# Altium schematic sheet CAN.SchDoc
size A4; SheetNumber: 2; SheetTotal: 6
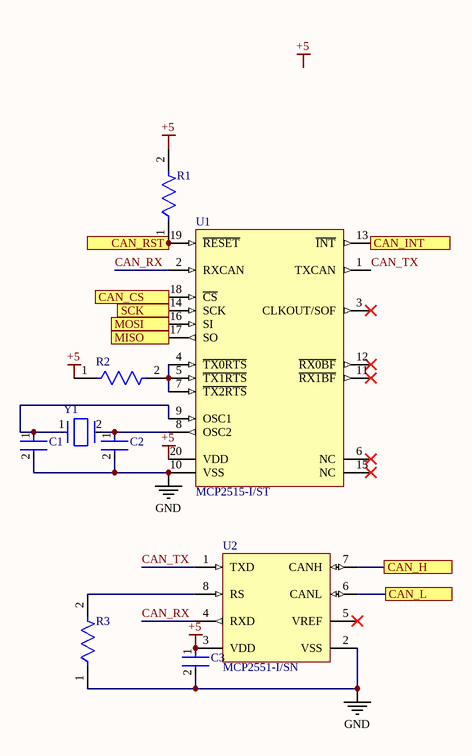
[diagram p0: CAN.SchDoc]

## Parts
C1  C0603C220J5GACTU  [FP-C0603C-CF-MFG]  (value not drawn)
C2  C0603C220J5GACTU  [FP-C0603C-CF-MFG]  (value not drawn)
C3  GRM033R60J104KE19D  [FP-GRM033-0_03-MFG]  (value not drawn)
R1  ERJ-2RKF1003X  [FP-ERJ2RK-IPC_C]  (value not drawn)
R2  ERJ-2RKF1003X  [FP-ERJ2RK-IPC_C]  (value not drawn)
R3  ERJ-3GEYJ100V  [FP-ERJ3G-MFG]  (value not drawn)
U1  MCP2515-I/ST  [TSSOP-ST20_N]
U2  MCP2551-I/SN  [MCHP-SN8_V]
Y1  ABLS-16.000MHZ-K4T  [FP-ABLS-MFG]  (value not drawn)

## Ports
CAN_CS, CAN_H, CAN_INT, CAN_L, CAN_RST, MISO, MOSI, SCK

## Nets
+5: C3.1 R1.2 R2.1 U1.20(VDD) U2.3(VDD)
GND: C1.2 C2.2 C3.2 R3.1 U1.10(VSS) U2.2(VSS)
CAN_CS: U1.18(~{CS}) ; port CAN_CS
CAN_H: U2.7(CANH) ; port CAN_H
CAN_INT: U1.13(~{INT}) ; port CAN_INT
CAN_L: U2.6(CANL) ; port CAN_L
CAN_RST: R1.1 U1.19(~{RESET}) ; port CAN_RST
CAN_RX: U1.2(RXCAN) U2.4(RXD)
CAN_TX: U1.1(TXCAN) U2.1(TXD)
MISO: U1.17(SO) ; port MISO
MOSI: U1.16(SI) ; port MOSI
SCK: U1.14(SCK) ; port SCK
NetC1_1: C1.1 U1.9(OSC1) Y1.1
NetC2_1: C2.1 U1.8(OSC2) Y1.2
NetR2_2: R2.2 U1.4(~{TX0RTS}) U1.5(~{TX1RTS}) U1.7(~{TX2RTS})
NetR3_2: R3.2 U2.8(RS)

Not connected (* = marked no-connect by the designer): U1 3(CLKOUT/SOF)* 6(NC)* 11(~{RX1BF})* 12(~{RX0BF})* 15(NC)*; U2 5(VREF)*

## Notes on the sheet
- Labels drawn without touching a wire or pin: +5

## Library data of the parts
C1 C2 = CMP-2006-03119-3: Cap Ceramic 22pF 50V C0G 5% SMD 0603 125°C Paper T/R; Manufacturer: KEMET; Description: C0603 22 pF C0G 30ppm/°C 5.00% 50 V; Temperature Coefficient: 30ppm/°C; Automotive Grade: Grade 1; Tolerance: 0.05; RoHS: TRUE; Temperature Characteristic: C0G; Capacitance: 22 pF; Device Class L3: Ceramic Capacitors; Digikey Description: Cap Ceramic 22pF 50V C0G 5% SMD 0603 125°C Paper T/R; ComponentLink2URL: https://api.kemet.com/component-edge/download/datasheet/C0603C100J5GACAUTO.pdf; ComponentLink2Description: Datasheet; Automotive: Yes; Temperature: -55°C to +125°C; Temperature Range High: +125°C; Package: C0603C-CF; Device Class L1: Passive Components; Device Class L2: Capacitors; Lead Free: Yes; Value: 22 pF; Manufacturer Part Number: C0603C220J5GACTU; Category: Cap; Mouser Description: Cap Ceramic 22pF 50V C0G 5% SMD 0603 125°C Paper T/R; Voltage Rating: 50 V; Height: 0.87mm; Material: Ceramic; Temperature Range Low: -55°C; Octopart: https://octopart.com/c0603c220j5gactu-kemet-98525
C3 = CMP-06035-000062-2: Chip Multilayer Ceramic Capacitors for General Purpose, 0201, 0.10uF, X5R, 15%, 10%, 6.3V; Capacitance: 100nF; Min Operating Temperature: -55°C; Lead Free: Lead Free; Radiation Hardening: No; Dielectric: X5R; Voltage Rating (DC): 6.3V; REACH SVHC: No SVHC; Case/Package: 0201; Voltage Rating: 6.3V; Length: 0.6mm; Max Operating Temperature: 85°C; Width: 0.012inch; Depth: 0.3mm; Material: Ceramic; Case Code (Metric): 0603; Thickness: 0.013inch; Packaging: Tape and Reel; Height: 0.3mm; Weight: 6E-06oz; Package Quantity: 1; Mount: Surface Mount; Voltage: 6.3V; Case Code (Imperial): 0201; Tolerance: 10%; Termination: SMD/SMT
R1 R2 = CMP-2002-00608-4: RES SMD 100K OHM 1% 1/10W 0402; Resistance: 100kR; Voltage Rating (DC): 50V; Power Rating: 100mW; Temperature Coefficient: 100ppm/°C; Case/Package: 0402; Length: 1mm; Package Quantity: 1; Radiation Hardening: No; Case Code (Metric): 1005; Contact Plating: Tin; Mount: Surface Mount; Depth: 0.5mm; Max Operating Temperature: 155°C; Lead Free: Lead Free; Width: 0.5mm; Composition: Thick Film; Case Code (Imperial): 0402; Tolerance: 1%; Termination: SMD/SMT; Number of Pins: 2; Height: 0.35mm; Voltage Rating: 50V; Military Standard: Not; REACH SVHC: No SVHC; Packaging: Tape and Reel; Min Operating Temperature: -55°C; Max Power Dissipation: 100mW; Features: Automotive AEC-Q200; Number of Terminations: 2
R3 = CMP-2000-00701-2: RES SMD 10 OHM 5% 1/10W 0603; Manufacturer: Panasonic; Voltage Rating: 75V; Power Rating: 0.1W; Description: Thick Film Resistors - SMD 0603 10ohms 5% AEC-Q200; Resistance: 10Ω; Value: 10Ω; Automotive Grade: Grade 0; Temperature Coefficient: 200ppm/°C; Device Class L2: Resistors; Tolerance: 5%; Device Class L3: Chip SMD Resistors; Digikey Description: RES SMD 10 OHM 5% 1/10W 0603; Package: ERJ3G; Automotive: Yes; RoHS: TRUE; Temperature: -55°C to +155°C; Ipc Land Pattern Name: CAPC16080X45; Series: ERJ; Lead Free: Yes; Mouser Description: Thick Film Resistors - SMD 0603 10ohms 5% AEC-Q200; Temperature Range Low: -55°C; Device Class L1: Passive Components; Temperature Range High: +155°C; ComponentLink2URL: https://industrial.panasonic.com/cdbs/www-data/pdf/RDA0000/AOA0000C301.pdf; Category: Res; Manufacturer Part Number: ERJ-3GEYJ100V; Composition: Thick Film; Height: 0.55mm; Footprint Url: https://industrial.panasonic.com/cdbs/www-data/pdf/RDA0000/DMA0000COL17.pdf; Octopart: https://octopart.com/erj-3geyj100v-panasonic-55389239; ComponentLink2Description: Datasheet
U1 = CMP-0186-00077-2: Stand-Alone CAN Controller With SPI Interface, 20-Pin TSSOP, Industrial Temperature; DatasheetVersion: revF, Oct-2010; ComponentLink1Description: Manufacturer URL; PackageDescription: 20-Lead Plastic Thin Shrink Small Outline (ST) - 4.4mm Body [TSSOP]; ComponentLink1URL: http://www.microchip.com/; RevisionNote: URLs added. DatasheetVersion updated.; PackageReference: TSSOP-ST20; Code_JEDEC: MO-153-AC; ComponentLink2Description: Datasheet; ComponentLink2URL: http://ww1.microchip.com/downloads/en/DeviceDoc/21801f.pdf; PackageVersion: revBB, Aug-2009; ComponentLink3URL: http://www.microchip.com/stellent/groups/techpub_sg/documents/packagingspec/en012702.pdf; ComponentLink3Description: Package Specification
U2 = CMP-0186-00138-3: High-Speed CAN Transceiver, / 1 Mb/s, 4.5 to 5.5 V, 8-Pin SOIC (SN), Industrial Temperature, RoHS, Tube; Manufacturer: Microchip; RoHSCompliant: true; PackageReference: SN8; ComponentLink1URL: http://www.microchip.com/; DatasheetVersion: Rev. F, 07/2010; ComponentLink2Description: Datasheet; ComponentLink2URL: http://ww1.microchip.com/downloads/en/DeviceDoc/21667f.pdf; ComponentLink3Description: Package Specification; PackageDescription: 8-Pin Small Outline Integrated Circuit, Body 4.9 x 3.9 mm, Pitch 1.27 mm; ComponentLink1Description: Manufacturer URL; Mounting Technology: Surface Mount; ComponentLink3URL: http://www.microchip.com/stellent/groups/techpub_sg/documents/packagingspec/en012702.pdf
Y1 = CMP-27762-000003-1: CRYSTAL 16.0000MHZ 18PF SMD; Manufacturer: Abracon; Frequency: 16MHz; Stability: 50ppm; Tolerance: 30ppm; Description: 16MHz ±30ppm Crystal 18pF 40 Ohms HC-49/US; Standoff Height: 0mm; Esr: 40Ω; ComponentLink2URL: https://abracon.com/Resonators/abls.pdf; Temperature Range High: +125°C; Package: ABLS; Device Class L3: Crystals; Temperature: -40°C to +125°C; Load Capacitance: 18pF; Device Class L2: Crystals / Oscillators; Mouser Description: Crystal 16MHz ±30ppm (Tol) ±50ppm (Stability) 18pF FUND 40Ohm 2-Pin HC-49/US SMD T/R; Category: Crys; ComponentLink2Description: Datasheet; Manufacturer Part Number: ABLS-16.000MHZ-K4T; Series: ABLS; Automotive: No; Octopart: https://octopart.com/abls-16.000mhz-k4t-abracon-18618626; RoHS: TRUE; Digikey Description: CRYSTAL 16.0000MHZ 18PF SMD; Temperature Range Low: -40°C; Lead Free: Yes; Height: 4.3mm; Device Class L1: Passive Components